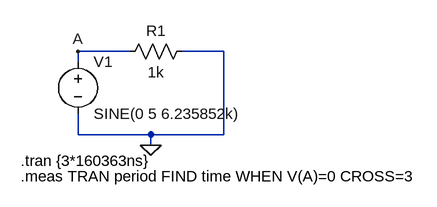
[diagram p0: schematic 2b.asc]
2b.asc, the LTspice schematic file:
Version 4
SHEET 1 988 680
WIRE 192 64 112 64
WIRE 336 64 272 64
WIRE 112 80 112 64
WIRE 112 192 112 160
WIRE 224 192 112 192
WIRE 336 192 336 64
WIRE 336 192 224 192
WIRE 224 208 224 192
FLAG 224 208 0
FLAG 112 64 A
SYMBOL voltage 112 64 R0
WINDOW 123 0 0 Left 0
WINDOW 39 0 0 Left 0
SYMATTR InstName V1
SYMATTR Value SINE(0 5 6.235852k)
SYMBOL res 288 48 R90
WINDOW 0 0 56 VBottom 2
WINDOW 3 32 56 VTop 2
SYMATTR InstName R1
SYMATTR Value 1k
TEXT 24 232 Left 2 !.tran {3*160363ns}
TEXT 24 256 Left 2 !.meas TRAN period FIND time WHEN V(A)=0 CROSS=3

The netlist it stands for:
* 2b.asc
V1 A 0 SINE(0 5 6.235852k)
R1 0 A 1k
.tran {3*160363ns}
.meas TRAN period FIND time WHEN V(A)=0 CROSS=3
.backanno
.end